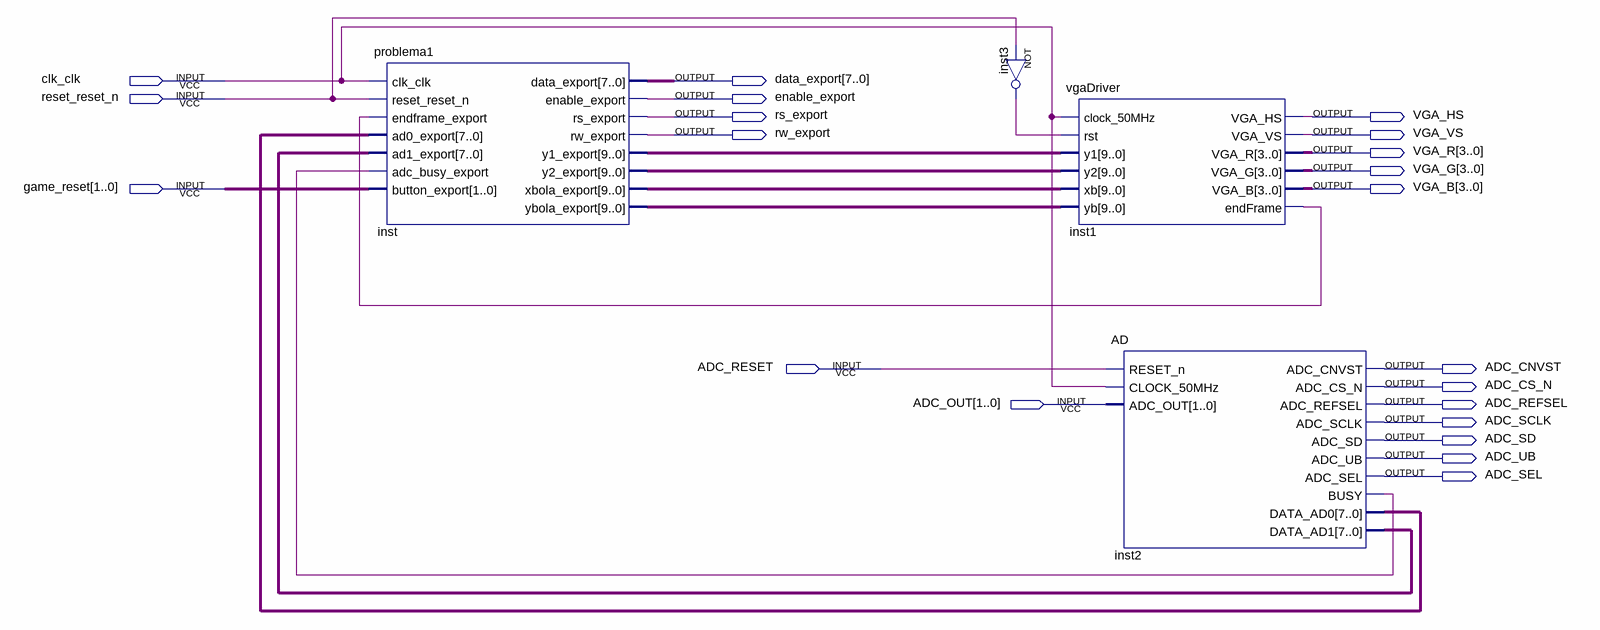
[diagram p0: schematic sheet]
// Quartus schematic TopLevel.bdf as structural Verilog: 4 symbols, 21 pins
module TopLevel (
  input  clk_clk,
  input  reset_reset_n,
  input  [1:0] game_reset,
  input  ADC_RESET,
  input  [1:0] ADC_OUT,
  output [7:0] data_export,
  output enable_export,
  output rs_export,
  output VGA_HS,
  output rw_export,
  output VGA_VS,
  output [3:0] VGA_R,
  output [3:0] VGA_G,
  output [3:0] VGA_B,
  output ADC_CNVST,
  output ADC_CS_N,
  output ADC_REFSEL,
  output ADC_SCLK,
  output ADC_SD,
  output ADC_UB,
  output ADC_SEL
);

  wire inst1_endframe, inst2_busy, inst3_out;
  wire [7:0] inst2_data_ad0, inst2_data_ad1;
  wire [9:0] inst_xbola_export, inst_y1_export, inst_y2_export, inst_ybola_export;

  problema1 inst (
    .clk_clk(clk_clk), .reset_reset_n(reset_reset_n), .endframe_export(inst1_endframe),
    .ad0_export(inst2_data_ad0), .ad1_export(inst2_data_ad1), .adc_busy_export(inst2_busy),
    .button_export(game_reset), .data_export(data_export), .enable_export(enable_export),
    .rs_export(rs_export), .rw_export(rw_export), .y1_export(inst_y1_export), .y2_export(inst_y2_export),
    .xbola_export(inst_xbola_export), .ybola_export(inst_ybola_export));
  not inst3 (inst3_out, reset_reset_n);
  vgaDriver inst1 (
    .clock_50MHz(clk_clk), .rst(inst3_out), .y1(inst_y1_export), .y2(inst_y2_export), .xb(inst_xbola_export),
    .yb(inst_ybola_export), .VGA_HS(VGA_HS), .VGA_VS(VGA_VS), .VGA_R(VGA_R), .VGA_G(VGA_G), .VGA_B(VGA_B),
    .endFrame(inst1_endframe));
  AD inst2 (
    .RESET_n(ADC_RESET), .CLOCK_50MHz(clk_clk), .ADC_OUT(ADC_OUT), .ADC_CNVST(ADC_CNVST),
    .ADC_CS_N(ADC_CS_N), .ADC_REFSEL(ADC_REFSEL), .ADC_SCLK(ADC_SCLK), .ADC_SD(ADC_SD), .ADC_UB(ADC_UB),
    .ADC_SEL(ADC_SEL), .BUSY(inst2_busy), .DATA_AD0(inst2_data_ad0), .DATA_AD1(inst2_data_ad1));
endmodule
